# Altium schematic sheet FT2232HQ.SchDoc: FTDI FT2232 USB Interface
size A4; : Record=PageOptions|CenterHorizontal=True|CenterVertical=True|PrintScale=1.39|XCorrection=1.00|YCorrection=1.00|PrintKind=0|BorderSize=5000000|LeftOffset=0|BottomOffset=0|Orientation=2|PaperLength=1000|PaperWidth=1000|Scale=100|PaperSource=7|PrintQuality=-4|MediaType=1|DitherType=10|PaperKind=A3 (297 x 420mm)|PrintScal; KeyComponent: FT2232HQ; CircuitClass: Communications; CircuitSubClass: USB; PageSetup: Record=PageOptions|CenterHorizontal=True|CenterVertical=True|PrintScale=1.00|XCorrection=1.00|YCorrection=1.00|PrintKind=0|BorderSize=5000000|LeftOffset=0|BottomOffset=0|Orientation=2|PaperLength=1000|PaperWidth=1000|Scale=100|PaperSource=7|PrintQuality=-4|MediaType=1|DitherType=10|PaperKind=Letter|PrintScaleMode=1
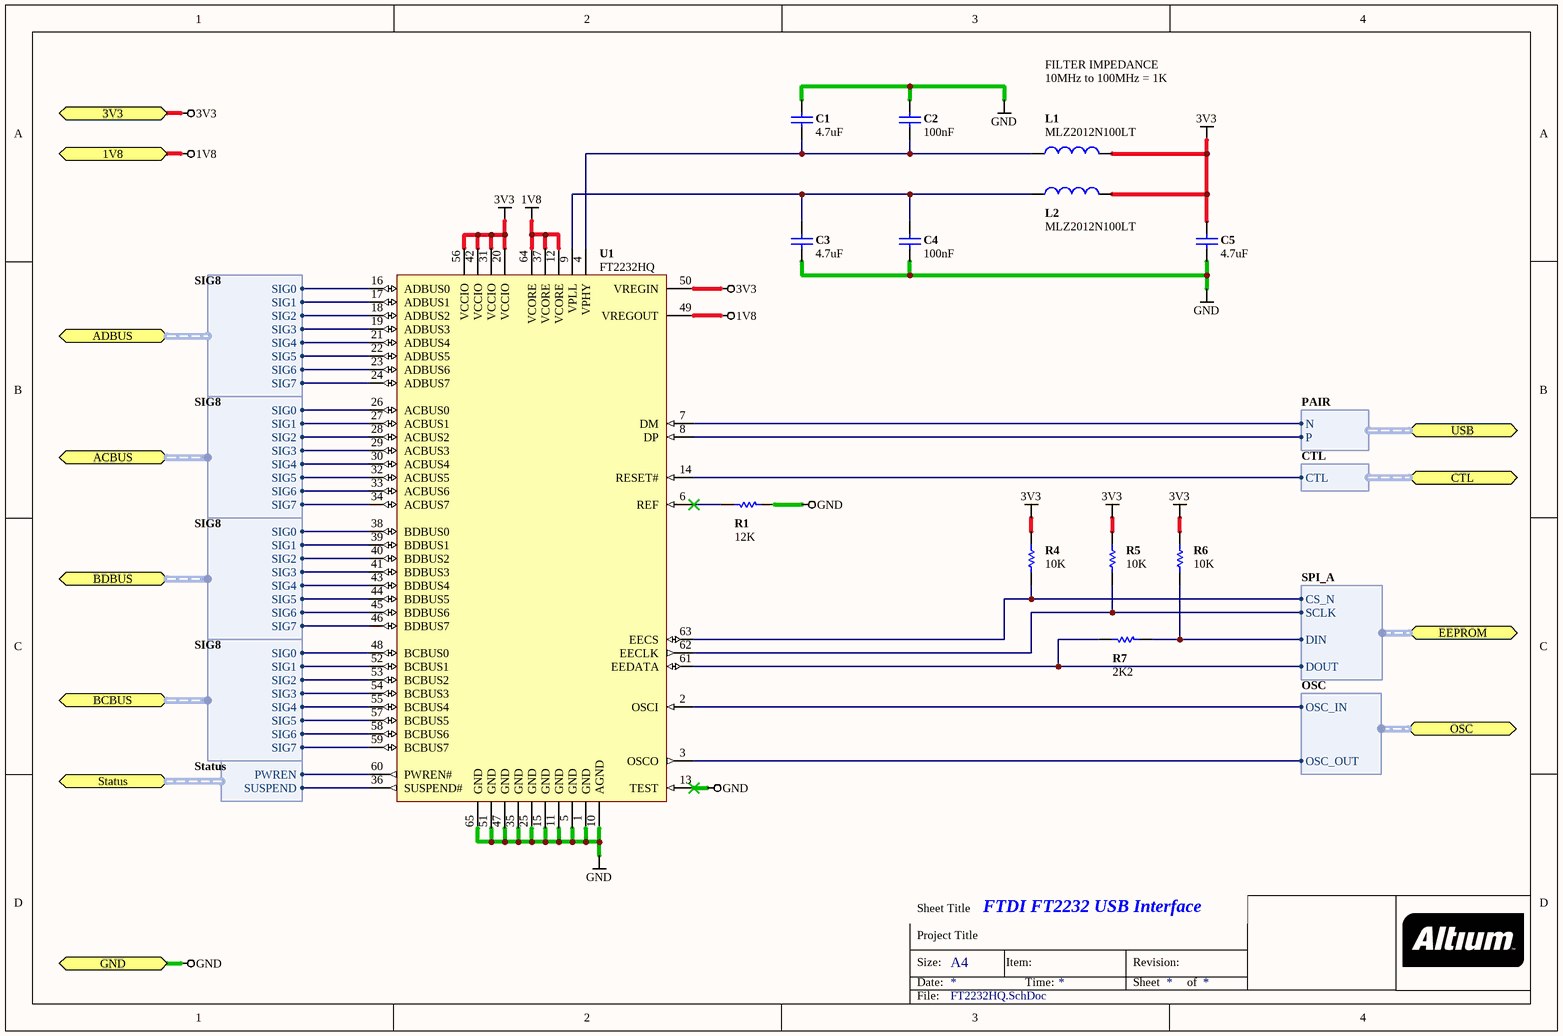
[diagram p0: FT2232HQ.SchDoc]

## Parts
C1  value 4.7uF  [CAPC0402(1005)60_N]  (hidden comment: CAP 4.7uF 6.3V 0402(1005))
C2  value 100nF  [CAPC0402(1005)60_N]  (hidden comment: CAP 100nF 16V 0402(1005))
C3  value 4.7uF  [CAPC0402(1005)60_N]  (hidden comment: CAP 4.7uF 6.3V 0402(1005))
C4  value 100nF  [CAPC0402(1005)60_N]  (hidden comment: CAP 100nF 16V 0402(1005))
C5  value 4.7uF  [CAPC0402(1005)60_N]  (hidden comment: CAP 4.7uF 6.3V 0402(1005))
L1  MLZ2012N100LT  [TDK-0805(2012)125]
L2  MLZ2012N100LT  [TDK-0805(2012)125]
R1  12K  [RESC0402(1005)_N]
R4  10K  [RESC0402(1005)_N]
R5  10K  [RESC0402(1005)_N]
R6  10K  [RESC0402(1005)_N]
R7  2K2  [RESC0402(1005)_N]
U1  FT2232HQ  [QFN64_2_N]

## Ports
1V8, 3V3, ACBUS (harness SIG8), ADBUS (harness SIG8), BCBUS (harness SIG8), BDBUS (harness SIG8), CTL (harness CTL), EEPROM (harness SPI_A), GND, OSC (harness OSC), Status (harness Status), USB (harness PAIR)

## Harnesses
PAIR: N, P
SIG8: SIG0, SIG1, SIG2, SIG3, SIG4, SIG5, SIG6, SIG7
SPI_A: CS_N, DIN, DOUT, SCLK
CTL: CTL
Status: SUSPEND, PWREN
OSC: OSC_IN, OSC_OUT

## Nets
1V8: U1.12(VCORE) U1.37(VCORE) U1.49(VREGOUT) U1.64(VCORE) ; port 1V8
3V3: C5.1 L1.1 L2.1 R4.2 R5.2 R6.2 U1.20(VCCIO) U1.31(VCCIO) U1.42(VCCIO) U1.50(VREGIN) U1.56(VCCIO) ; port 3V3
GND: C1.2 C2.2 C3.1 C4.1 C5.2 R1.2 U1.1(GND) U1.5(GND) U1.10(AGND) U1.11(GND) U1.13(TEST) U1.15(GND) U1.25(GND) U1.35(GND) U1.47(GND) U1.51(GND) U1.65(GND) ; port GND
NetC1_1: C1.1 C2.1 L1.2 U1.4(VPHY)
NetC3_2: C3.2 C4.2 L2.2 U1.9(VPLL)
NetR1_1: R1.1 U1.6(REF)
NetR4_1: R4.1 U1.63(EECS) ; port EEPROM.CS_N
NetR5_1: R5.1 U1.62(EECLK) ; port EEPROM.SCLK
NetR6_1: R6.1 R7.1 ; port EEPROM.DIN
NetR7_2: R7.2 U1.61(EEDATA) ; port EEPROM.DOUT
NetU1_2: U1.2(OSCI) ; port OSC.OSC_IN
NetU1_3: U1.3(OSCO) ; port OSC.OSC_OUT
NetU1_7: U1.7(DM) ; port USB.N
NetU1_8: U1.8(DP) ; port USB.P
NetU1_14: U1.14(RESET#) ; port CTL.CTL
NetU1_16: U1.16(ADBUS0) ; port ADBUS.SIG0
NetU1_17: U1.17(ADBUS1) ; port ADBUS.SIG1
NetU1_18: U1.18(ADBUS2) ; port ADBUS.SIG2
NetU1_19: U1.19(ADBUS3) ; port ADBUS.SIG3
NetU1_21: U1.21(ADBUS4) ; port ADBUS.SIG4
NetU1_22: U1.22(ADBUS5) ; port ADBUS.SIG5
NetU1_23: U1.23(ADBUS6) ; port ADBUS.SIG6
NetU1_24: U1.24(ADBUS7) ; port ADBUS.SIG7
NetU1_26: U1.26(ACBUS0) ; port ACBUS.SIG0
NetU1_27: U1.27(ACBUS1) ; port ACBUS.SIG1
NetU1_28: U1.28(ACBUS2) ; port ACBUS.SIG2
NetU1_29: U1.29(ACBUS3) ; port ACBUS.SIG3
NetU1_30: U1.30(ACBUS4) ; port ACBUS.SIG4
NetU1_32: U1.32(ACBUS5) ; port ACBUS.SIG5
NetU1_33: U1.33(ACBUS6) ; port ACBUS.SIG6
NetU1_34: U1.34(ACBUS7) ; port ACBUS.SIG7
NetU1_36: U1.36(SUSPEND#) ; port Status.SUSPEND
NetU1_38: U1.38(BDBUS0) ; port BDBUS.SIG0
NetU1_39: U1.39(BDBUS1) ; port BDBUS.SIG1
NetU1_40: U1.40(BDBUS2) ; port BDBUS.SIG2
NetU1_41: U1.41(BDBUS3) ; port BDBUS.SIG3
NetU1_43: U1.43(BDBUS4) ; port BDBUS.SIG4
NetU1_44: U1.44(BDBUS5) ; port BDBUS.SIG5
NetU1_45: U1.45(BDBUS6) ; port BDBUS.SIG6
NetU1_46: U1.46(BDBUS7) ; port BDBUS.SIG7
NetU1_48: U1.48(BCBUS0) ; port BCBUS.SIG0
NetU1_52: U1.52(BCBUS1) ; port BCBUS.SIG1
NetU1_53: U1.53(BCBUS2) ; port BCBUS.SIG2
NetU1_54: U1.54(BCBUS3) ; port BCBUS.SIG3
NetU1_55: U1.55(BCBUS4) ; port BCBUS.SIG4
NetU1_57: U1.57(BCBUS5) ; port BCBUS.SIG5
NetU1_58: U1.58(BCBUS6) ; port BCBUS.SIG6
NetU1_59: U1.59(BCBUS7) ; port BCBUS.SIG7
NetU1_60: U1.60(PWREN#) ; port Status.PWREN

## Notes on the sheet
- FILTER IMPEDANCE
- 10MHz to 100MHz = 1K
- Sheet Title
- Project Title
- Size:
- Date:
- A4
- Item:
- Time:
- Revision:
- Sheet
- of
- File:

## Library data of the parts
C1 C3 C5 = CMP-1034-02137-1: CAP 4.7uF 6.3V ?0% 0402 (1005 Metric) Thickness 0.6mm SMD; Case-Metric: 1005; Case-EIA: 0402; Technology: SMT; Max Thickness: 0.6 mm; Tolerance: ?0%; Rated Voltage: 6.3 V
C2 C4 = CMP-1034-02069-1: CAP 100nF 16V ±10% 0402 (1005 Metric) Thickness 0.6mm SMD; Case-EIA: 0402; Case-Metric: 1005; Max Thickness: 0.6 mm; Tolerance: ±10%; Rated Voltage: 16 V; Technology: SMT
L1 L2 = CMP-5175-00000-1: Multilayer Inductor, 10 uH, ±20%, 300 mOhm, 50MHz, 0805(2012); DC Resistance: 0.30 Ohm; Class: Passive; IEC-class: Fixed inductor; Sub-class: Inductor
R1 = CMP-1011-00100-1: 12K 0.063W 5% 0402 (1005 Metric)  SMD; Value: 12000.00 Ohm; Case-Metric: 1005; Case-EIA: 0402; Tolerance: 5 %; Power: 0.063 W; Technology: SMT
R4-R6 = CMP-1011-00098-1: 10K 0.063W 5% 0402 (1005 Metric)  SMD; Case-EIA: 0402; Case-Metric: 1005; Value: 10000.00 Ohm; Tolerance: 5 %; Power: 0.063 W; Technology: SMT
R7 = CMP-1011-00082-1: 2K2 0.063W 5% 0402 (1005 Metric)  SMD; Value: 2200.00 Ohm; Case-EIA: 0402; Case-Metric: 1005; Tolerance: 5 %; Power: 0.063 W; Technology: SMT
U1 = CMP-0078-00003-2: Dual High Speed USB To Multipurpose UART/FIFO IC, QFN-64, Tray; DatasheetVersion: ver 2.10, Nov-2010; ComponentLink1Description: Manufacturer URL; PackageVersion: 2010; ComponentLink1URL: http://www.ftdichip.com/; PackageReference: QFN64_2; PackageDescription: 64-Pin Quad Flat No-Lead, 9 x 9 mm Body, 0.5 mm Pitch, 4.35 x 4.35 mm Exposed Pad; RevisionNote: URLs added.; ComponentLink2URL: http://www.ftdichip.com/Support/Documents/DataSheets/ICs/DS_FT2232H.pdf; ComponentLink2Description: Datasheet